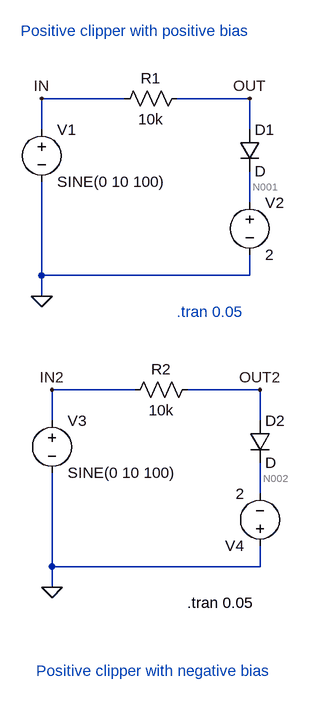
[diagram p0: schematic Clipper_parallel_positive_with_positive_and_negative_bias.asc]
Clipper_parallel_positive_with_positive_and_negative_bias.asc, the LTspice schematic file:
Version 4.1
SHEET 1 880 960
WIRE 208 64 80 64
WIRE 400 64 288 64
WIRE 80 112 80 64
WIRE 400 112 400 64
WIRE 400 224 400 176
WIRE 80 336 80 192
WIRE 400 336 400 304
WIRE 400 336 80 336
WIRE 80 368 80 336
WIRE 224 512 96 512
WIRE 416 512 304 512
WIRE 96 560 96 512
WIRE 416 560 416 512
WIRE 416 672 416 624
WIRE 96 784 96 640
WIRE 416 784 416 752
WIRE 416 784 96 784
WIRE 96 816 96 784
FLAG 80 368 0
FLAG 80 64 IN
FLAG 400 64 OUT
FLAG 96 816 0
FLAG 96 512 IN2
FLAG 416 512 OUT2
SYMBOL voltage 80 96 R0
WINDOW 123 0 0 Left 0
WINDOW 39 0 0 Left 0
SYMATTR InstName V1
SYMATTR Value SINE(0 10 100)
SYMBOL res 304 48 R90
WINDOW 0 0 56 VBottom 2
WINDOW 3 32 56 VTop 2
SYMATTR InstName R1
SYMATTR Value 10k
SYMBOL diode 384 112 R0
SYMATTR InstName D1
SYMBOL voltage 400 208 R0
WINDOW 123 0 0 Left 0
WINDOW 39 0 0 Left 0
SYMATTR InstName V2
SYMATTR Value 2
SYMBOL voltage 96 544 R0
WINDOW 123 0 0 Left 0
WINDOW 39 0 0 Left 0
SYMATTR InstName V3
SYMATTR Value SINE(0 10 100)
SYMBOL res 320 496 R90
WINDOW 0 0 56 VBottom 2
WINDOW 3 32 56 VTop 2
SYMATTR InstName R2
SYMATTR Value 10k
SYMBOL diode 400 560 R0
SYMATTR InstName D2
SYMBOL voltage 416 768 R180
WINDOW 123 0 0 Left 0
WINDOW 39 0 0 Left 0
SYMATTR InstName V4
SYMATTR Value 2
TEXT 288 392 Left 2 ;.tran 0.05
TEXT 304 840 Left 2 !.tran 0.05
TEXT 48 -40 Left 2 ;Positive clipper with positive bias
TEXT 72 944 Left 2 ;Positive clipper with negative bias

The netlist it stands for:
* Clipper_parallel_positive_with_positive_and_negative_bias.asc
V1 IN 0 SINE(0 10 100)
R1 OUT IN 10k
D1 OUT N001 D
V2 N001 0 2
V3 IN2 0 SINE(0 10 100)
R2 OUT2 IN2 10k
D2 OUT2 N002 D
V4 0 N002 2
.model D D
.lib standard.dio
* .tran 0.05
.tran 0.05
* Positive clipper with positive bias
* Positive clipper with negative bias
.backanno
.end

* Results of the author's LTspice run, read from the files saved beside the schematic
* Operating Point, zero values left out:
*   V(out) = 20.1 nV
*   V(out2) = -1.396 V
*   V(n001) = 2 V
*   V(n002) = -2 V
*   I(V1) = 2.01 pA
*   I(R2) = -139.6 µA
*   I(D1) = -2.01 pA
*   I(V3) = -139.6 µA
*   I(V4) = -139.6 µA
*   I(R1) = 2.01 pA
*   I(V2) = -2.01 pA
*   I(D2) = 139.6 µA
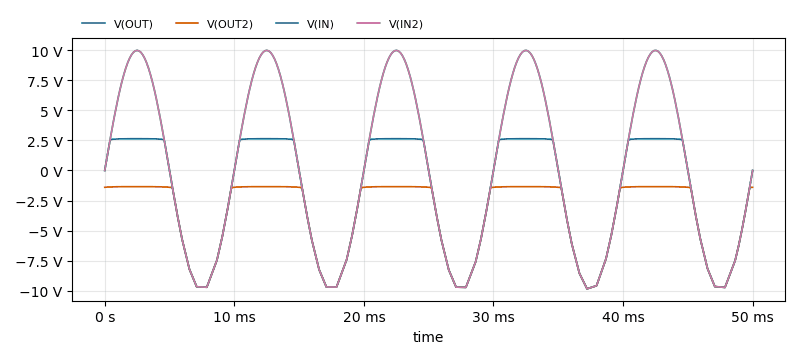
[diagram p1: Transient Analysis of Clipper_parallel_positive_with_positive_and_negative_bias.asc, plotted from the saved traces]
* Transient Analysis, 1 run:
*   V(OUT): min -9.848 V, max 2.647 V, average -1.938 V, rms 5.255 V, last 0 V
*   V(OUT2): min -9.848 V, max -1.342 V, average -3.852 V, rms 5.051 V, last -1.396 V
*   V(IN): min -9.848 V, max 10 V, average 39.09 mV, rms 7.038 V, last 0 V
*   V(IN2): min -9.848 V, max 10 V, average 39.09 mV, rms 7.038 V, last 0 V